# Altium project TC_TP3.PrjPcb
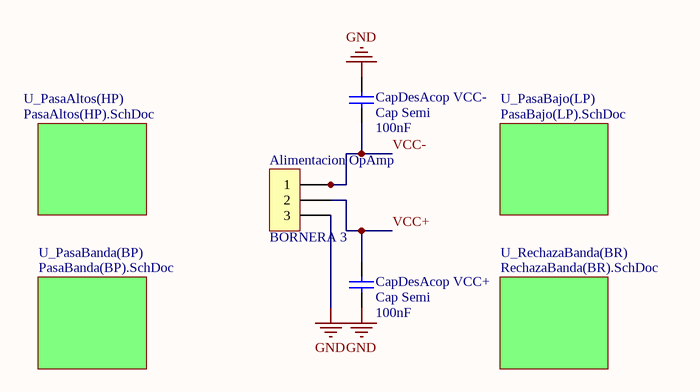
[diagram p0: TopSheet.SchDoc]
4 sheets, 31 parts. Net scope: global (net labels, ports and power ports of the same name join across sheets).
Board file: PCB1.PcbDoc
Sheets:
  TopSheet.SchDoc
    U_PasaAltos(HP) = PasaAltos(HP).SchDoc
    U_PasaBajo(LP) = PasaBajo(LP).SchDoc
    U_RechazaBanda(BR) = RechazaBanda(BR).SchDoc

## Sheet TopSheet.SchDoc
size A4

### Parts
Alimentacion_OpAmp  BORNERA 3  [BORNERA3]
CapDesAcop_VCC+  Cap Semi  value 100nF  [C0805]
CapDesAcop_VCC-  Cap Semi  value 100nF  [C0805]

### Sub-sheets
U_PasaAltos(HP) = PasaAltos(HP).SchDoc: no entries
U_PasaBajo(LP) = PasaBajo(LP).SchDoc: no entries
U_PasaBanda(BP) = PasaBanda(BP).SchDoc (file not in this document): no entries
U_RechazaBanda(BR) = RechazaBanda(BR).SchDoc: no entries

### Nets
GND: Alimentacion_OpAmp.3 CapDesAcop_VCC+.1 CapDesAcop_VCC-.1
VCC+: Alimentacion_OpAmp.2 CapDesAcop_VCC+.2
VCC-: Alimentacion_OpAmp.1 CapDesAcop_VCC-.2

### Library data of the parts
CapDesAcop_VCC+ CapDesAcop_VCC- = Cap Semi: Capacitor (Semiconductor SIM Model); Published: 8-Jun-2000; LatestRevisionDate: 29-May-2009; LatestRevisionNote: IPC-7351 Footprint Added.; PackageReference: C1206; Publisher: Altium Limited; PackageDescription: Chip Capacitor

## Sheet PasaAltos(HP).SchDoc
size A4
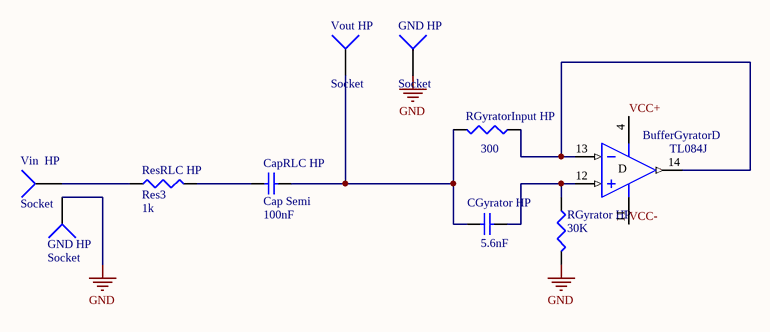
[diagram p1: PasaAltos(HP).SchDoc]

### Parts
(Parts that share a designator on the sheet are numbered #1, #2 ... from top to bottom, then left to right.)
BufferGyrator  TL084J  [J014]  (part D of 4)
CapRLC_HP  Cap Semi  value 100nF  [C0805]
CGyrator_HP  value 5.6nF  [C0805]  (hidden comment: Cap Semi)
GND_HP#1  Socket  [PIN1]
GND_HP#2  Socket  [PIN1]
ResRLC_HP  Res3  value 1k  [6-0805_M]
RGyrator_HP  value 30K  [6-0805_M]  (hidden comment: Res3)
RGyratorInput_HP  value 300  [6-0805_M]  (hidden comment: Res3)
Vin_HP  Socket  [PIN1]
Vout_HP  Socket  [PIN1]

### Nets
GND: GND_HP#1.1 GND_HP#2.1 RGyrator_HP.2
VCC+: BufferGyrator.4(V+)
VCC-: BufferGyrator.11(V-)
NetBufferGyrator_12: BufferGyrator.12(IN+) CGyrator_HP.1 RGyrator_HP.1
NetBufferGyrator_13: BufferGyrator.13(IN-) BufferGyrator.14(OUT) RGyratorInput_HP.1
NetCapRLC_HP_1: CapRLC_HP.1 CGyrator_HP.2 RGyratorInput_HP.2 Vout_HP.1
NetCapRLC_HP_2: CapRLC_HP.2 ResRLC_HP.2
NetResRLC_HP_1: ResRLC_HP.1 Vin_HP.1

### Notes on the sheet
- (in symbol TL084J, part D) D

### Library data of the parts
BufferGyrator = TL084J: JFET-Input Operational Amplifier; Published: 16-Jan-2001; LatestRevisionDate: 04-Mar-2005; LatestRevisionNote: Stylized 3D Model Added.; DatasheetVersion: Feb-1999; PackageVersion: Jun-1999; PackageReference: J014; Publisher: Altium Limited; PackageDescription: DIP; 14 Leads; Row Spacing 7.62 mm; Pitch 2.54 mm; ComponentLink1Description: Manufacturer Link; ComponentLink1URL: http://www.ti.com/; ComponentLink2Description: Datasheet; ComponentLink2URL: http://www-s.ti.com/sc/ds/tl084.pdf
CapRLC_HP CGyrator_HP = Cap Semi: Capacitor (Semiconductor SIM Model); Published: 8-Jun-2000; LatestRevisionDate: 29-May-2009; LatestRevisionNote: IPC-7351 Footprint Added.; PackageReference: C1206; Publisher: Altium Limited; PackageDescription: Chip Capacitor
ResRLC_HP RGyrator_HP RGyratorInput_HP = Res3: Resistor; Published: 8-Jun-2000; LatestRevisionDate: 29-May-2009; LatestRevisionNote: IPC-7351 Footprint Added.; PackageReference: J1-0603; Publisher: Altium Limited; PackageDescription: Chip Resistor
GND_HP#1 GND_HP#2 Vin_HP Vout_HP = Socket: LatestRevisionDate: 17-Jul-2002; LatestRevisionNote: Re-released for DXP Platform.; Publisher: Altium Limited

## Sheet PasaBajo(LP).SchDoc
size A4
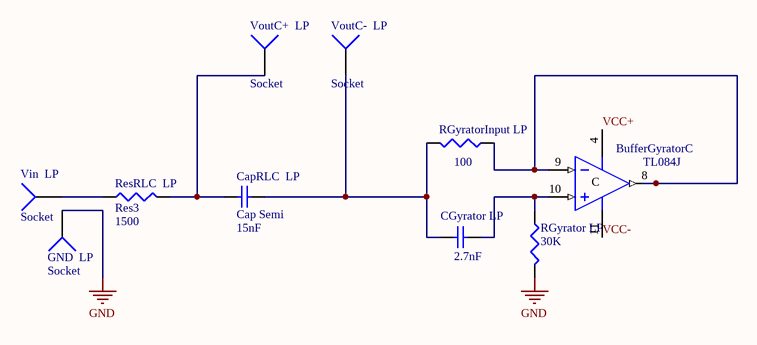
[diagram p2: PasaBajo(LP).SchDoc]

### Parts
BufferGyrator  TL084J  [J014]  (part C of 4)
CapRLC_LP  Cap Semi  value 15nF  [C0805]
CGyrator_LP  value 2.7nF  [C0805]  (hidden comment: Cap Semi)
GND_LP  Socket  [PIN1]
ResRLC_LP  Res3  value 1500  [6-0805_M]
RGyrator_LP  value 30K  [6-0805_M]  (hidden comment: Res3)
RGyratorInput_LP  value 100  [6-0805_M]  (hidden comment: Res3)
Vin_LP  Socket  [PIN1]
VoutC+_LP  Socket  [PIN1]
VoutC-_LP  Socket  [PIN1]

### Nets
GND: GND_LP.1 RGyrator_LP.2
VCC+: BufferGyrator.4(V+)
VCC-: BufferGyrator.11(V-)
NetBufferGyrator_8: BufferGyrator.8(OUT) BufferGyrator.9(IN-) RGyratorInput_LP.1
NetBufferGyrator_10: BufferGyrator.10(IN+) CGyrator_LP.1 RGyrator_LP.1
NetCapRLC_LP_1: CapRLC_LP.1 CGyrator_LP.2 RGyratorInput_LP.2 VoutC-_LP.1
NetCapRLC_LP_2: CapRLC_LP.2 ResRLC_LP.2 VoutC+_LP.1
NetResRLC_LP_1: ResRLC_LP.1 Vin_LP.1

### Notes on the sheet
- (in symbol TL084J, part C) C

### Library data of the parts
BufferGyrator = TL084J: JFET-Input Operational Amplifier; Published: 16-Jan-2001; LatestRevisionDate: 04-Mar-2005; LatestRevisionNote: Stylized 3D Model Added.; DatasheetVersion: Feb-1999; PackageVersion: Jun-1999; PackageReference: J014; Publisher: Altium Limited; PackageDescription: DIP; 14 Leads; Row Spacing 7.62 mm; Pitch 2.54 mm; ComponentLink1Description: Manufacturer Link; ComponentLink1URL: http://www.ti.com/; ComponentLink2Description: Datasheet; ComponentLink2URL: http://www-s.ti.com/sc/ds/tl084.pdf
CapRLC_LP CGyrator_LP = Cap Semi: Capacitor (Semiconductor SIM Model); Published: 8-Jun-2000; LatestRevisionDate: 29-May-2009; LatestRevisionNote: IPC-7351 Footprint Added.; PackageReference: C1206; Publisher: Altium Limited; PackageDescription: Chip Capacitor
ResRLC_LP RGyrator_LP RGyratorInput_LP = Res3: Resistor; Published: 8-Jun-2000; LatestRevisionDate: 29-May-2009; LatestRevisionNote: IPC-7351 Footprint Added.; PackageReference: J1-0603; Publisher: Altium Limited; PackageDescription: Chip Resistor
GND_LP Vin_LP VoutC+_LP VoutC-_LP = Socket: LatestRevisionDate: 17-Jul-2002; LatestRevisionNote: Re-released for DXP Platform.; Publisher: Altium Limited

## Sheet RechazaBanda(BR).SchDoc
size A4
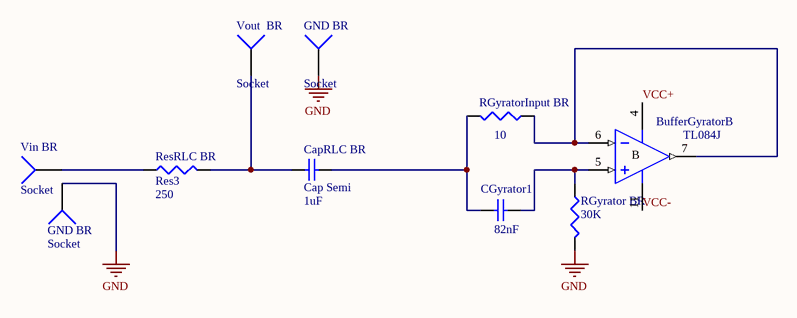
[diagram p3: RechazaBanda(BR).SchDoc]

### Parts
(Parts that share a designator on the sheet are numbered #1, #2 ... from top to bottom, then left to right.)
BufferGyrator  TL084J  [J014]  (part B of 4)
CapRLC_BR  Cap Semi  value 1uF  [C0805]
CGyrator1  value 82nF  [C0805]  (hidden comment: Cap Semi)
GND_BR#1  Socket  [PIN1]
GND_BR#2  Socket  [PIN1]
ResRLC_BR  Res3  value 250  [6-0805_M]
RGyrator_BR  value 30K  [6-0805_M]  (hidden comment: Res3)
RGyratorInput_BR  value 10  [6-0805_M]  (hidden comment: Res3)
Vin_BR  Socket  [PIN1]
Vout_BR  Socket  [PIN1]

### Nets
GND: GND_BR#1.1 GND_BR#2.1 RGyrator_BR.2
VCC+: BufferGyrator.4(V+)
VCC-: BufferGyrator.11(V-)
NetBufferGyrator_5: BufferGyrator.5(IN+) CGyrator1.1 RGyrator_BR.1
NetBufferGyrator_6: BufferGyrator.6(IN-) BufferGyrator.7(OUT) RGyratorInput_BR.1
NetCapRLC_BR_1: CapRLC_BR.1 CGyrator1.2 RGyratorInput_BR.2
NetCapRLC_BR_2: CapRLC_BR.2 ResRLC_BR.2 Vout_BR.1
NetResRLC_BR_1: ResRLC_BR.1 Vin_BR.1

### Notes on the sheet
- (in symbol TL084J, part B) B

### Library data of the parts
BufferGyrator = TL084J: JFET-Input Operational Amplifier; Published: 16-Jan-2001; LatestRevisionDate: 04-Mar-2005; LatestRevisionNote: Stylized 3D Model Added.; DatasheetVersion: Feb-1999; PackageVersion: Jun-1999; PackageReference: J014; Publisher: Altium Limited; PackageDescription: DIP; 14 Leads; Row Spacing 7.62 mm; Pitch 2.54 mm; ComponentLink1Description: Manufacturer Link; ComponentLink1URL: http://www.ti.com/; ComponentLink2Description: Datasheet; ComponentLink2URL: http://www-s.ti.com/sc/ds/tl084.pdf
CapRLC_BR CGyrator1 = Cap Semi: Capacitor (Semiconductor SIM Model); Published: 8-Jun-2000; LatestRevisionDate: 29-May-2009; LatestRevisionNote: IPC-7351 Footprint Added.; PackageReference: C1206; Publisher: Altium Limited; PackageDescription: Chip Capacitor
ResRLC_BR RGyrator_BR RGyratorInput_BR = Res3: Resistor; Published: 8-Jun-2000; LatestRevisionDate: 29-May-2009; LatestRevisionNote: IPC-7351 Footprint Added.; PackageReference: J1-0603; Publisher: Altium Limited; PackageDescription: Chip Resistor
GND_BR#1 GND_BR#2 Vin_BR Vout_BR = Socket: LatestRevisionDate: 17-Jul-2002; LatestRevisionNote: Re-released for DXP Platform.; Publisher: Altium Limited

## Nets that join several sheets
GND: TopSheet (Alimentacion_OpAmp.3 CapDesAcop_VCC+.1 CapDesAcop_VCC-.1), PasaAltos(HP) (GND_HP#1.1 GND_HP#2.1 RGyrator_HP.2), PasaBajo(LP) (GND_LP.1 RGyrator_LP.2), RechazaBanda(BR) (GND_BR#1.1 GND_BR#2.1 RGyrator_BR.2)
VCC+: TopSheet (Alimentacion_OpAmp.2 CapDesAcop_VCC+.2), PasaAltos(HP) (BufferGyrator.4), PasaBajo(LP) (BufferGyrator.4), RechazaBanda(BR) (BufferGyrator.4)
VCC-: TopSheet (Alimentacion_OpAmp.1 CapDesAcop_VCC-.2), PasaAltos(HP) (BufferGyrator.11), PasaBajo(LP) (BufferGyrator.11), RechazaBanda(BR) (BufferGyrator.11)